# Altium schematic sheet 5-MCU.SchDoc
size 594 x 420 mm; SheetNumber: 5; SheetTotal: 7; PageSetup: Record=PageOptions|CenterHorizontal=False|CenterVertical=False|PrintScale=0.43|XCorrection=0.00|YCorrection=0.00|PrintKind=1|BorderSize=5000000|LeftOffset=0|BottomOffset=0|Orientation=2|PaperLength=5940|PaperWidth=4200|Scale=100|PaperSource=7|PrintQuality=-4|MediaType=1|DitherType=10|PaperKind=Personal. 1: 215,9 x 279,4 mm|PrintScaleMode=0; NumTotalFolhas: 7; NumFolha: 5
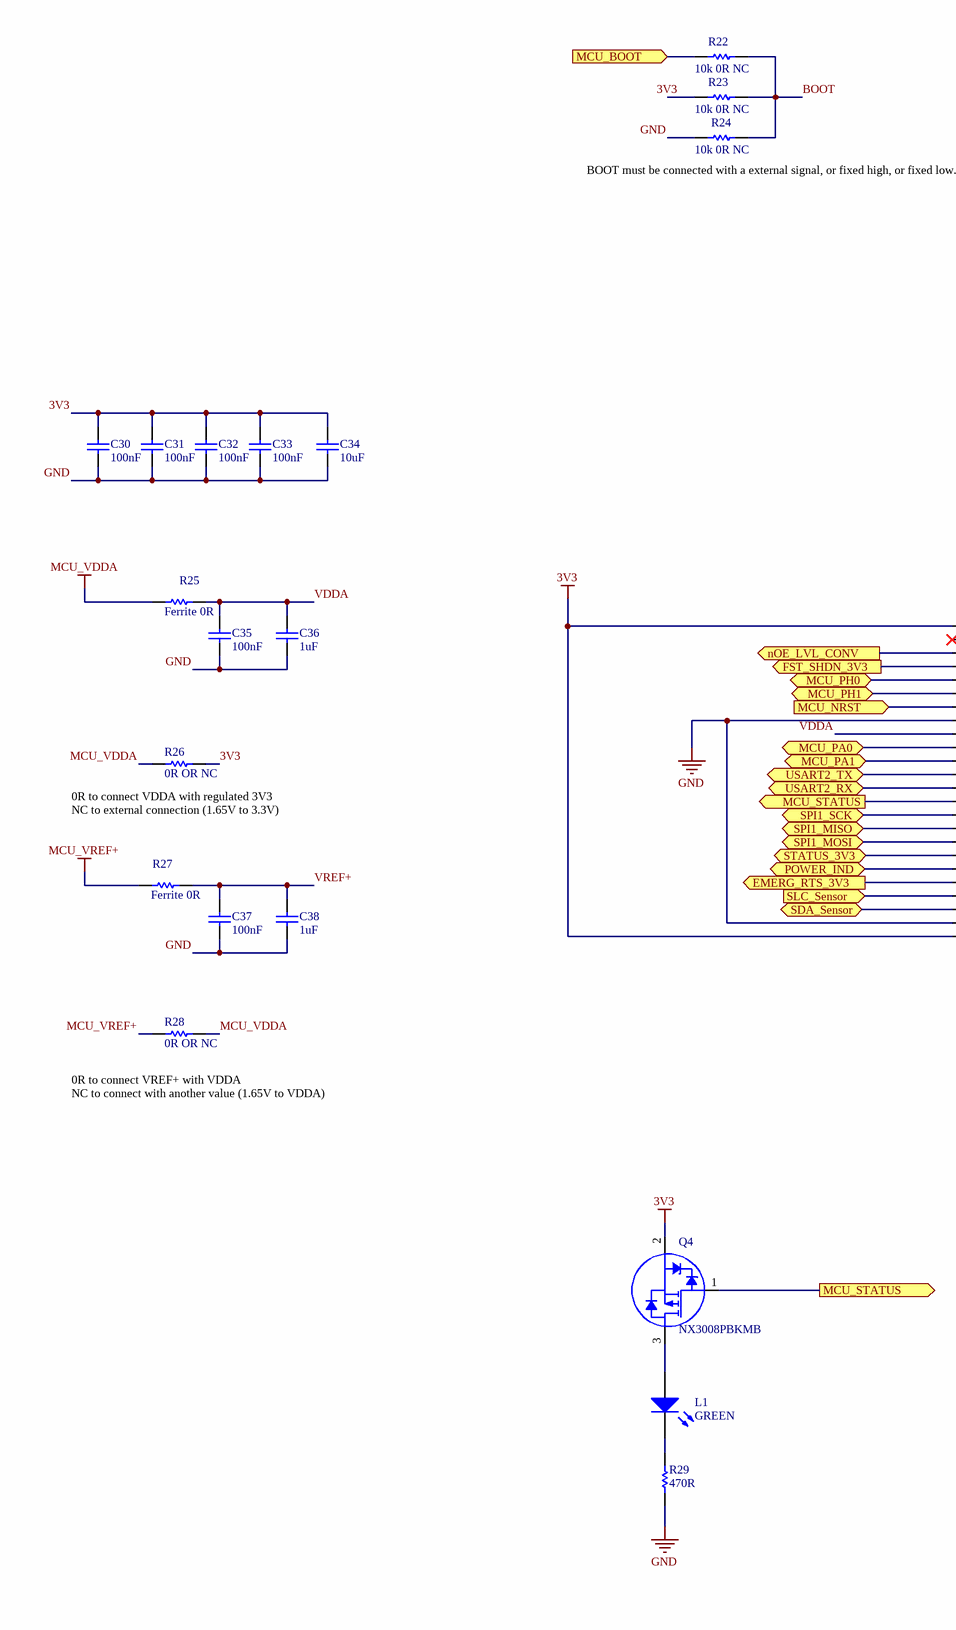
[diagram p0: 5-MCU.SchDoc, left]
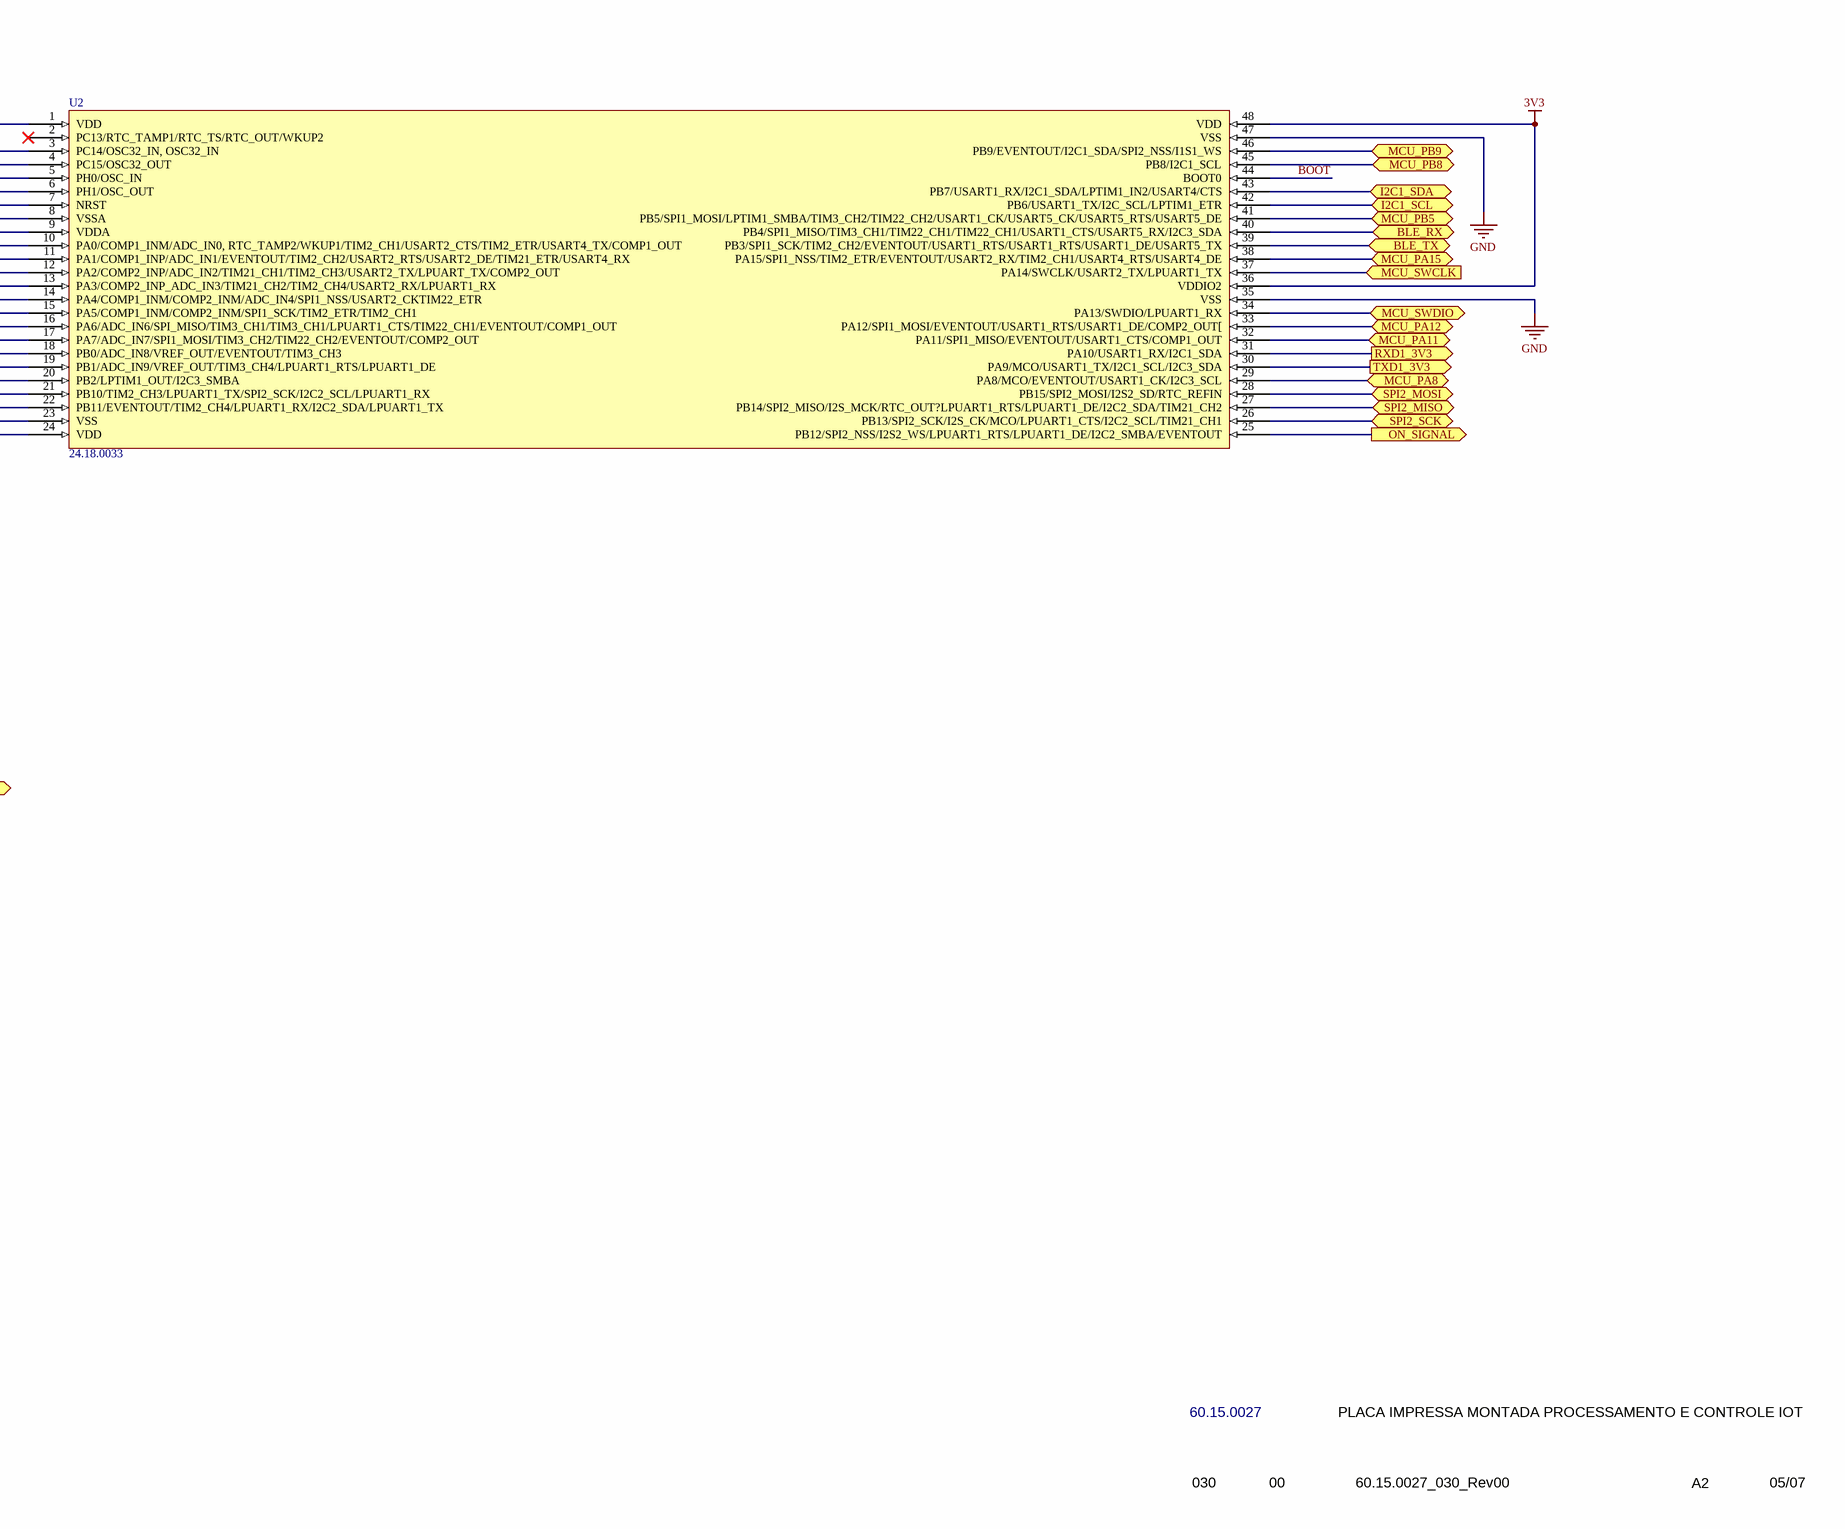
[diagram p1: 5-MCU.SchDoc, right]

## Parts
C30  16.23.0803  [16.23.0803]  (value not drawn)
C31  16.23.0803  [16.23.0803]  (value not drawn)
C32  16.23.0803  [16.23.0803]  (value not drawn)
C33  16.23.0803  [16.23.0803]  (value not drawn)
C34  value 10uF  [16.23.0805]  (hidden comment: 16.23.0805)
C35  16.23.0803  [16.23.0803]  (value not drawn)
C36  value 1uF  [16.23.0806]  (hidden comment: 16.23.0806)
C37  16.23.0803  [16.23.0803]  (value not drawn)
C38  value 1uF  [16.23.0806]  (hidden comment: 16.23.0806)
L1  32.17.0036  [32.17.0036]  (value not drawn)
Q4  72.19.0071  [72.19.0071]  (value not drawn)
R22  value 10k 0R NC  [66.21.1646]  (hidden comment: 66.21.1646)
R23  value 10k 0R NC  [66.21.1646]  (hidden comment: 66.21.1646)
R24  value 10k 0R NC  [66.21.1646]  (hidden comment: 66.21.1646)
R25  value Ferrite 0R  [66.24.1337]  (hidden comment: 66.24.1337)
R26  value 0R OR NC  [66.24.1337]  (hidden comment: 66.24.1337)
R27  value Ferrite 0R  [66.24.1337]  (hidden comment: 66.24.1337)
R28  value 0R OR NC  [66.24.1337]  (hidden comment: 66.24.1337)
R29  value 470R  [66.33.4700]  (hidden comment: 66.33.4700)
U2  24.18.0033  [24.18.0033]

## Ports
BLE_RX (bidir), BLE_TX (bidir), EMERG_RTS_3V3 (out), FST_SHDN_3V3 (out), I2C1_SCL (bidir), I2C1_SDA (bidir), MCU_BOOT (in), MCU_NRST (in), MCU_PA0 (bidir), MCU_PA1 (bidir), MCU_PA8 (bidir), MCU_PA11 (bidir), MCU_PA12 (bidir), MCU_PA15 (bidir), MCU_PB5 (bidir), MCU_PB8 (bidir), MCU_PB9 (bidir), MCU_PH0 (bidir), MCU_PH1 (bidir), MCU_STATUS (out), MCU_SWCLK (in), MCU_SWDIO (bidir), nOE_LVL_CONV (out), ON_SIGNAL (out), POWER_IND (bidir), RXD1_3V3 (out), SDA_Sensor (bidir), SLC_Sensor (in), SPI1_MISO (bidir), SPI1_MOSI (bidir), SPI1_SCK (bidir), SPI2_MISO (bidir), SPI2_MOSI (bidir), SPI2_SCK (bidir), STATUS_3V3 (bidir), TXD1_3V3 (out), USART2_RX (bidir), USART2_TX (bidir)

## Nets
3V3: C30.2 C31.2 C32.2 C33.2 C34.2 Q4.2(S) R23.1 R26.2 U2.1(VDD) U2.24(VDD) U2.36(VDDIO2) U2.48(VDD)
GND: C30.1 C31.1 C32.1 C33.1 C34.1 C35.1 C36.1 C37.1 C38.1 R24.1 R29.1 U2.8(VSSA) U2.23(VSS) U2.35(VSS) U2.47(VSS)
MCU_VDDA: R25.1 R26.1 R28.2
MCU_VREF+: R27.1 R28.1
BLE_RX: U2.40(PB4/SPI1_MISO/TIM3_CH1/TIM22_CH1/TIM22_CH1/USART1_CTS/USART5_RX/I2C3_SDA) ; port BLE_RX
BLE_TX: U2.39(PB3/SPI1_SCK/TIM2_CH2/EVENTOUT/USART1_RTS/USART1_RTS/USART1_DE/USART5_TX) ; port BLE_TX
BOOT: R22.2 R23.2 R24.2 U2.44(BOOT0)
EMERG_RTS_3V3: U2.20(PB2/LPTIM1_OUT/I2C3_SMBA) ; port EMERG_RTS_3V3
FST_SHDN_3V3: U2.4(PC15/OSC32_OUT) ; port FST_SHDN_3V3
I2C1_SCL: U2.42(PB6/USART1_TX/I2C_SCL/LPTIM1_ETR) ; port I2C1_SCL
I2C1_SDA: U2.43(PB7/USART1_RX/I2C1_SDA/LPTIM1_IN2/USART4/CTS) ; port I2C1_SDA
MCU_BOOT: R22.1 ; port MCU_BOOT
MCU_NRST: U2.7(NRST) ; port MCU_NRST
MCU_PA0: U2.10(PA0/COMP1_INM/ADC_IN0,_RTC_TAMP2/WKUP1/TIM2_CH1/USART2_CTS/TIM2_ETR/USART4_TX/COMP1_OUT) ; port MCU_PA0
MCU_PA1: U2.11(PA1/COMP1_INP/ADC_IN1/EVENTOUT/TIM2_CH2/USART2_RTS/USART2_DE/TIM21_ETR/USART4_RX) ; port MCU_PA1
MCU_PA8: U2.29(PA8/MCO/EVENTOUT/USART1_CK/I2C3_SCL) ; port MCU_PA8
MCU_PA11: U2.32(PA11/SPI1_MISO/EVENTOUT/USART1_CTS/COMP1_OUT) ; port MCU_PA11
MCU_PA12: U2.33(PA12/SPI1_MOSI/EVENTOUT/USART1_RTS/USART1_DE/COMP2_OUT[) ; port MCU_PA12
MCU_PA15: U2.38(PA15/SPI1_NSS/TIM2_ETR/EVENTOUT/USART2_RX/TIM2_CH1/USART4_RTS/USART4_DE) ; port MCU_PA15
MCU_PB5: U2.41(PB5/SPI1_MOSI/LPTIM1_SMBA/TIM3_CH2/TIM22_CH2/USART1_CK/USART5_CK/USART5_RTS/USART5_DE) ; port MCU_PB5
MCU_PB8: U2.45(PB8/I2C1_SCL) ; port MCU_PB8
MCU_PB9: U2.46(PB9/EVENTOUT/I2C1_SDA/SPI2_NSS/I1S1_WS) ; port MCU_PB9
MCU_PH0: U2.5(PH0/OSC_IN) ; port MCU_PH0
MCU_PH1: U2.6(PH1/OSC_OUT) ; port MCU_PH1
MCU_STATUS: Q4.1(G) U2.14(PA4/COMP1_INM/COMP2_INM/ADC_IN4/SPI1_NSS/USART2_CKTIM22_ETR) ; port MCU_STATUS
MCU_SWCLK: U2.37(PA14/SWCLK/USART2_TX/LPUART1_TX) ; port MCU_SWCLK
MCU_SWDIO: U2.34(PA13/SWDIO/LPUART1_RX) ; port MCU_SWDIO
nOE_LVL_CONV: U2.3(PC14/OSC32_IN,_OSC32_IN) ; port nOE_LVL_CONV
ON_SIGNAL: U2.25(PB12/SPI2_NSS/I2S2_WS/LPUART1_RTS/LPUART1_DE/I2C2_SMBA/EVENTOUT) ; port ON_SIGNAL
POWER_IND: U2.19(PB1/ADC_IN9/VREF_OUT/TIM3_CH4/LPUART1_RTS/LPUART1_DE) ; port POWER_IND
RXD1_3V3: U2.31(PA10/USART1_RX/I2C1_SDA) ; port RXD1_3V3
SDA_Sensor: U2.22(PB11/EVENTOUT/TIM2_CH4/LPUART1_RX/I2C2_SDA/LPUART1_TX) ; port SDA_Sensor
SLC_Sensor: U2.21(PB10/TIM2_CH3/LPUART1_TX/SPI2_SCK/I2C2_SCL/LPUART1_RX) ; port SLC_Sensor
SPI1_MISO: U2.16(PA6/ADC_IN6/SPI_MISO/TIM3_CH1/TIM3_CH1/LPUART1_CTS/TIM22_CH1/EVENTOUT/COMP1_OUT) ; port SPI1_MISO
SPI1_MOSI: U2.17(PA7/ADC_IN7/SPI1_MOSI/TIM3_CH2/TIM22_CH2/EVENTOUT/COMP2_OUT) ; port SPI1_MOSI
SPI1_SCK: U2.15(PA5/COMP1_INM/COMP2_INM/SPI1_SCK/TIM2_ETR/TIM2_CH1) ; port SPI1_SCK
SPI2_MISO: U2.27(PB14/SPI2_MISO/I2S_MCK/RTC_OUT?LPUART1_RTS/LPUART1_DE/I2C2_SDA/TIM21_CH2) ; port SPI2_MISO
SPI2_MOSI: U2.28(PB15/SPI2_MOSI/I2S2_SD/RTC_REFIN) ; port SPI2_MOSI
SPI2_SCK: U2.26(PB13/SPI2_SCK/I2S_CK/MCO/LPUART1_CTS/I2C2_SCL/TIM21_CH1) ; port SPI2_SCK
STATUS_3V3: U2.18(PB0/ADC_IN8/VREF_OUT/EVENTOUT/TIM3_CH3) ; port STATUS_3V3
TXD1_3V3: U2.30(PA9/MCO/USART1_TX/I2C1_SCL/I2C3_SDA) ; port TXD1_3V3
USART2_RX: U2.13(PA3/COMP2_INP_ADC_IN3/TIM21_CH2/TIM2_CH4/USART2_RX/LPUART1_RX) ; port USART2_RX
USART2_TX: U2.12(PA2/COMP2_INP/ADC_IN2/TIM21_CH1/TIM2_CH3/USART2_TX/LPUART_TX/COMP2_OUT) ; port USART2_TX
VDDA: C35.2 C36.2 R25.2 U2.9(VDDA)
VREF+: C37.2 C38.2 R27.2
NetL1_A: L1.A Q4.3(D)
NetL1_K: L1.K R29.2

Not connected (* = marked no-connect by the designer): U2 2(PC13/RTC_TAMP1/RTC_TS/RTC_OUT/WKUP2)*

## Notes on the sheet
- (near R24) BOOT must be connected with a external signal, or fixed high, or fixed low. Selection by resistor.
- (near R26) 0R to connect VDDA with regulated 3V3
- (near R26) NC to external connection (1.65V to 3.3V)
- (near R28) 0R to connect VREF+ with VDDA
- NC to connect with another value (1.65V to VDDA)
- 60.15.0027
- PLACA IMPRESSA MONTADA PROCESSAMENTO E CONTROLE IOT
- 030
- 00
- 60.15.0027_030_Rev00
- A2
- 05/07
- 1
- 2
- 3
- 4
- 5
- 6
- 7
- 8
- A
- B
- C
- D
- E
- F
- G
- H
- DOCUMENTO DE ENGENHARIA DE PRODUTO
- DOCUMENT OF PRODUCT ENGINEERING
- CÓDIGO / CODE
- DESCRIÇÃO / DESCRIPTION
- DOC
- REV
- ARQUIVO / FILE
- FORM./SIZE
- FOLHA / PAGE
- (in symbol 16.23.0803) 100nF
- (in symbol 32.17.0036) GREEN
- (in symbol 72.19.0071) NX3008PBKMB

## Library data of the parts
C30-C33 C35 C37 = 16.23.0803: CAPACITOR CERAMICO 100nF 16V 10%% X5R SMD 0201
C34 = 16.23.0805: CAPACITOR CERAMICO MULTICAMADAS 10uF 10V X5R 10% SMD 0603
C36 C38 = 16.23.0806: CAPACITOR CERAMICO MULTICAMADAS 1uF 10V X5R 20% SMD 0201
L1 = 32.17.0036: LED VERDE 0603 SMD
Q4 = 72.19.0071: MOSFET CANAL P SMD 30V 230mA SOT883B
R22-R24 = 66.21.1646: RESISTOR THICK FILM 10k OHMS 25V 0.05W 1% SMD 0201
R25-R28 = 66.24.1337: RESISTOR THICK FILM 0,1W 0 OHMS SMD 0603
R29 = 66.33.4700: RES MET 0,125W 470 OHMS 5% SMD 0805
U2 = 24.18.0033: MICROCONTROLADOR 32BITS ARM 192KB FLASH 48 PINOS LQFP; Part Number: STM32L071CZTx; Manufactor: STMICROELETRONICS; ComponentLink1Description: Value; ComponentLink1URL: STM32L071CZTx